# EAGLE design jlpcb-128 (EAGLE 5.11)
ABBREV: jn6; PROJECT: JeeNode v6

## Sheet 1 of 2
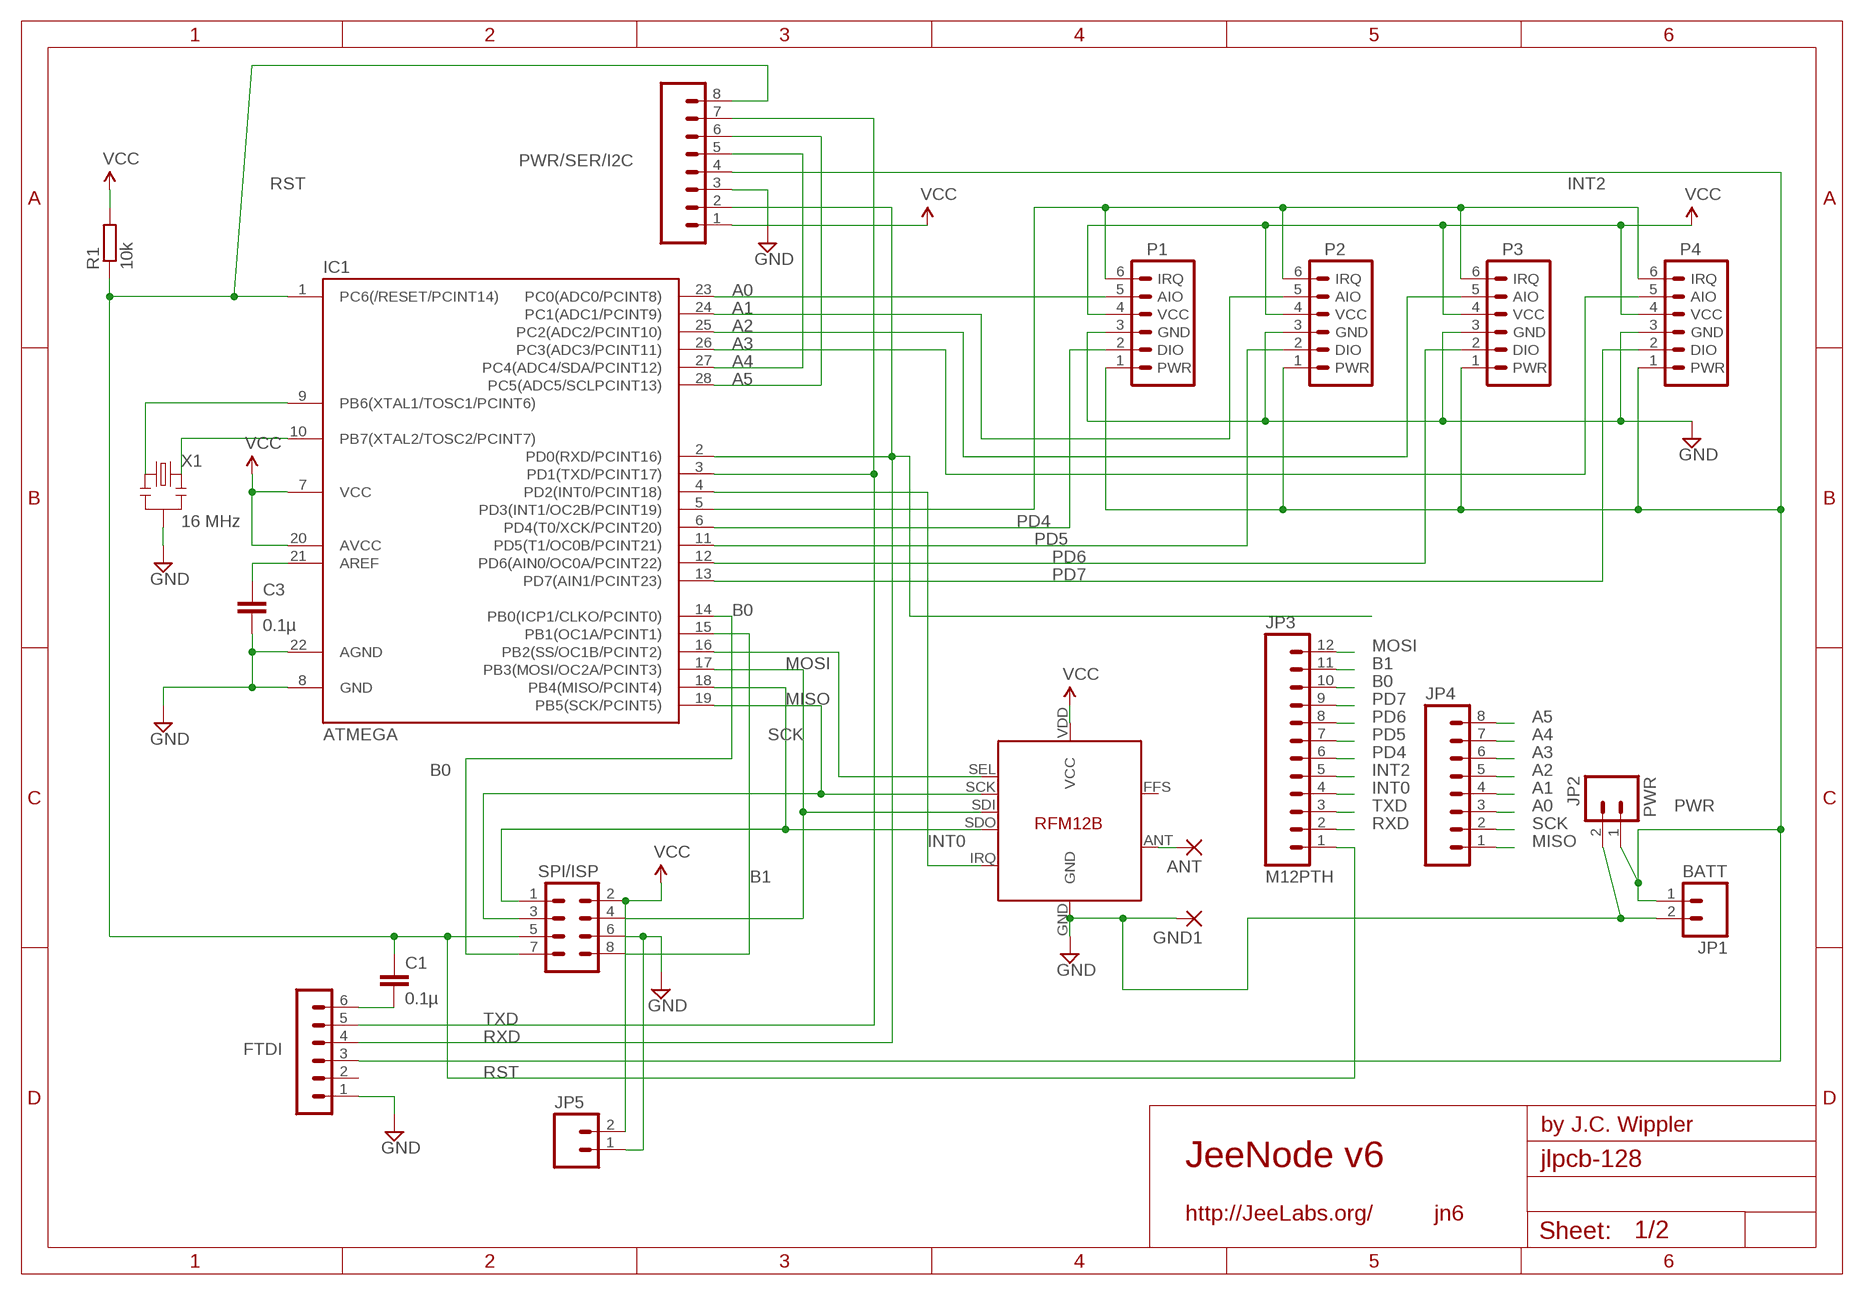
[diagram p0: schematic, sheet 1]

### Parts
ANT  1,6/0,8  [1,6/0,8]
C1  0.1µ  C-EU025-024X044  [C025-024X044]
C3  0.1µ  C-EU025-024X044  [C025-024X044]
FTDI  FTDI  MA06-1  [MA06-1]
GND1  1,6/0,8  [1,6/0,8]
IC1  ATMEGA  ATMEGA48/88/168-PU  [DIL28-3]
JP1  BATT  M02LOCK_LONGPADS  [1X02_LOCK_LONGPADS]
JP2  PWR  M02PTH  [1X02]
JP3  M12PTH  [1X12]
JP4  M081X08  [1X08]
JP5  M02PTH  [1X02]
P1  JEEPORT  JEEPORT-FEMALE  [1X06_FEMALE_LOCK.010]
P2  JEEPORT  JEEPORT-FEMALE  [1X06_FEMALE_LOCK.010]
P3  JEEPORT  JEEPORT-FEMALE  [1X06_FEMALE_LOCK.010]
P4  JEEPORT  JEEPORT-FEMALE  [1X06_FEMALE_LOCK.010]
PWR/SER/I2C  M081X08  [1X08]
R1  10k  R-EU_0204/7  [0204/7]
SV7  SPI/ISP  MA04-2  [MA04-2]
U$1  RFM12B  [RFM12B]
X1  16 MHz  RESONATORPTH  [RESONATOR-PTH]

### Nets
A0: IC1.23(PC0(ADC0/PCINT8)) JP4.3 P1.5(AIO)
A1: IC1.24(PC1(ADC1/PCINT9)) JP4.4 P2.5(AIO)
A2: IC1.25(PC2(ADC2/PCINT10)) JP4.5 P3.5(AIO)
A3: IC1.26(PC3(ADC3/PCINT11)) JP4.6 P4.5(AIO)
A4: IC1.27(PC4(ADC4/SDA/PCINT12)) JP4.7 PWR/SER/I2C.5
A5: IC1.28(PC5(ADC5/SCLPCINT13)) JP4.8 PWR/SER/I2C.6
B0: IC1.14(PB0(ICP1/CLKO/PCINT0)) JP3.10 SV7.7 ; also sheet 2
B1: IC1.15(PB1(OC1A/PCINT1)) JP3.11 SV7.8
GND [power]: C3.2 FTDI.1 GND1.1(P) IC1.8(GND) IC1.22(AGND) JP1.2 JP2.2 JP5.1 P1.3(GND) P2.3(GND) P3.3(GND) P4.3(GND) PWR/SER/I2C.3 SV7.6 U$1.GND X1.2 ; also sheet 2
INT0: IC1.4(PD2(INT0/PCINT18)) JP3.4 U$1.IRQ
INT2: IC1.5(PD3(INT1/OC2B/PCINT19)) JP3.5 P1.6(IRQ) P2.6(IRQ) P3.6(IRQ) P4.6(IRQ) ; also sheet 2
MISO: IC1.18(PB4(MISO/PCINT4)) JP4.1 SV7.1 U$1.SDO ; also sheet 2
MOSI: IC1.17(PB3(MOSI/OC2A/PCINT3)) JP3.12 SV7.4 U$1.SDI ; also sheet 2
N$1: IC1.9(PB6(XTAL1/TOSC1/PCINT6)) X1.1
N$4: IC1.16(PB2(SS/OC1B/PCINT2)) U$1.SEL
N$13: ANT.1(P) U$1.ANT
N$19: C3.1 IC1.21(AREF)
N$20: C1.2 FTDI.6
N$21: IC1.10(PB7(XTAL2/TOSC2/PCINT7)) X1.3
PD4: IC1.6(PD4(T0/XCK/PCINT20)) JP3.6 P1.2(DIO)
PD5: IC1.11(PD5(T1/OC0B/PCINT21)) JP3.7 P2.2(DIO)
PD6: IC1.12(PD6(AIN0/OC0A/PCINT22)) JP3.8 P3.2(DIO)
PD7: IC1.13(PD7(AIN1/PCINT23)) JP3.9 P4.2(DIO)
PWR [power]: FTDI.3 JP1.1 JP2.1 P1.1(PWR) P2.1(PWR) P3.1(PWR) P4.1(PWR) PWR/SER/I2C.4 ; also sheet 2
RST: C1.1 IC1.1(PC6(/RESET/PCINT14)) JP3.1 PWR/SER/I2C.8 R1.1 SV7.5 ; also sheet 2
RXD: FTDI.4 IC1.2(PD0(RXD/PCINT16)) JP3.2 PWR/SER/I2C.2
SCK: IC1.19(PB5(SCK/PCINT5)) JP4.2 SV7.3 U$1.SCK ; also sheet 2
TXD: FTDI.5 IC1.3(PD1(TXD/PCINT17)) JP3.3 PWR/SER/I2C.7
VCC [power]: IC1.7(VCC) IC1.20(AVCC) JP5.2 P1.4(VCC) P2.4(VCC) P3.4(VCC) P4.4(VCC) PWR/SER/I2C.1 R1.2 SV7.2 U$1.VDD(VCC) ; also sheet 2
Unconnected: FTDI.2 U$1.FFS

## Sheet 2 of 2
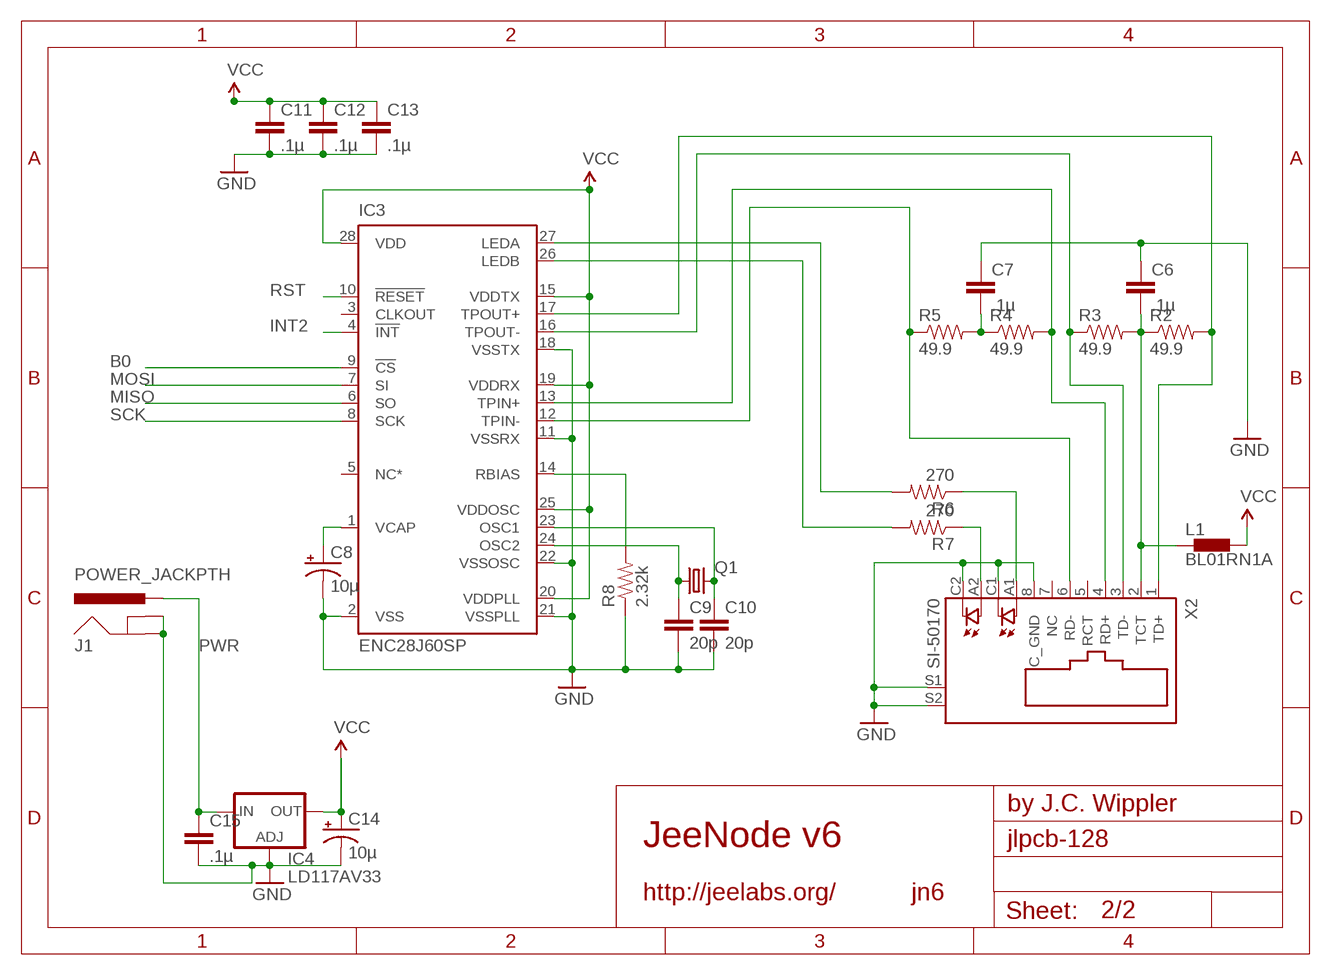
[diagram p1: schematic, sheet 2]

### Parts
C6  .1µ  CAPPTH  [CAP-PTH-SMALL]
C7  .1µ  CAPPTH  [CAP-PTH-SMALL]
C8  10µ  CAP_POLPTH2  [CPOL-RADIAL-10UF-25V]
C9  20p  CAPPTH  [CAP-PTH-SMALL]
C10  20p  CAPPTH  [CAP-PTH-SMALL]
C11  .1µ  CAPPTH  [CAP-PTH-SMALL]
C12  .1µ  CAPPTH  [CAP-PTH-SMALL]
C13  .1µ  CAPPTH  [CAP-PTH-SMALL]
C14  10µ  CAP_POLPTH2  [CPOL-RADIAL-10UF-25V]
C15  .1µ  CAPPTH  [CAP-PTH-SMALL]
IC3  ENC28J60SP  [DIL28-3]
IC4  LD117AV33  [TO220L1]
J1  POWER_JACKPTH  [POWER_JACK_PTH]
L1  BL01RN1A  [BL01RN1A]
Q1  CRYSTALHC49US  [HC49US]
R2  49.9  RESISTORPTH1  [AXIAL-0.3]
R3  49.9  RESISTORPTH1  [AXIAL-0.3]
R4  49.9  RESISTORPTH1  [AXIAL-0.3]
R5  49.9  RESISTORPTH1  [AXIAL-0.3]
R6  270  RESISTORPTH1  [AXIAL-0.3]
R7  270  RESISTORPTH1  [AXIAL-0.3]
R8  2.32k  RESISTORPTH1  [AXIAL-0.3]
X2  SI-50170  [SI-50170]

### Nets
B0: IC3.9(!CS) ; also sheet 1
GND [power]: C6.1 C7.1 C8.2(-) C9.2 C10.2 C11.2 C12.2 C13.2 C14.2(-) C15.2 IC3.2(VSS) IC3.11(VSSRX) IC3.18(VSSTX) IC3.21(VSSPLL) IC3.22(VSSOSC) IC4.1(ADJ) J1.GND J1.GNDBREAK R8.P$1 X2.8(C_GND) X2.C1(C) X2.C2(C1) X2.S1 X2.S2 ; also sheet 1
INT2: IC3.4(!INT) ; also sheet 1
MISO: IC3.6(SO) ; also sheet 1
MOSI: IC3.7(SI) ; also sheet 1
N$17 [power]: C6.2 L1.1 R2.P$1 R3.P$2 X2.2(TCT)
N$23 [power]: IC3.17(TPOUT+) R2.P$2 X2.1(TD+)
N$26 [power]: IC3.16(TPOUT-) R3.P$1 X2.3(TD-)
N$27 [power]: IC3.13(TPIN+) R4.P$2 X2.4(RD+)
N$28 [power]: IC3.12(TPIN-) R5.P$1 X2.6(RD-)
N$29: R6.P$1 X2.A1(A)
N$30: R7.P$1 X2.A2(A1)
N$31: IC3.26(LEDB) R7.P$2
N$32: IC3.27(LEDA) R6.P$2
N$33: C8.1(+) IC3.1(VCAP)
N$34: IC3.14(RBIAS) R8.P$2
N$35 [power]: C9.1 IC3.24(OSC2) Q1.1
N$36 [power]: C10.1 IC3.23(OSC1) Q1.2
N$37 [power]: C7.2 R4.P$1 R5.P$2
PWR [power]: C15.1 IC4.3(IN) J1.PWR ; also sheet 1
RST: IC3.10(!RESET) ; also sheet 1
SCK: IC3.8(SCK) ; also sheet 1
VCC [power]: C11.1 C12.1 C13.1 C14.1(+) IC3.15(VDDTX) IC3.19(VDDRX) IC3.20(VDDPLL) IC3.25(VDDOSC) IC3.28(VDD) IC4.2(OUT) L1.2 ; also sheet 1
Unconnected: IC3.3(CLKOUT) IC3.5(NC*) X2.5(RCT) X2.7(NC)

## Library data of the parts
ANT GND1 = JeeLabs:1,6/0,8: THROUGH-HOLE PAD
C1 C3 = resistor:C-EU: CAPACITOR, European symbol
C6 C7 C9-C13 C15 = SparkFun:CAP: Capacitor Standard 0603 ceramic capacitor, and 0.1" leaded capacitor.
C8 C14 = SparkFun:CAP_POL: Capacitor Polarized These are standard SMD and PTH capacitors. Normally 10uF, 47uF, and 100uF in electrolytic and tantalum varieties. Always verify the external diameter of the through hole cap, it varies with capacity, voltage, and manufacturer. The EIA devices should be standard.
FTDI = JeeLabs:MA06-1: PIN HEADER
IC1 = atmega8:ATMEGA48/88/168-PU
IC3 = microchip:ENC28J60: Stand-Alone Ethernet Controller with SPI Interface Source: http://ww1.microchip.com/downloads/en/DeviceDoc/39662c.pdf
IC4 = v-reg:LD117A?*: Low drop fixed and adjustable positive voltage regulators 1 A Source: http://www.st.com/stonline/products/literature/ds/7194/ld1117axx.pdf
J1 = SparkFun:POWER_JACK: Power Jack This is the standard 5.5mm barrel jack for power. The PTH is the most common, proven, reliable, footprint. All others are experimental. The Slot footprint only works if the mill layer is transmitted to the PCB fab house so be warned. Spark Fun Electronics SKU : PRT-00119. Mating wall wart : TOL-00298 (and others)
JP1 JP2 JP5 = SparkFun:M02: Header 2 Standard 2-pin 0.1" header. Use with straight break away headers (SKU : PRT-00116), right angle break away headers (PRT-00553), swiss pins (PRT-00743), machine pins (PRT-00117), and female headers (PRT-00115). Molex polarized connector foot print use with SKU : PRT-08233 with associated crimp pins and housings.
JP3 = SparkFun:M12: Header 12 Standard 12-pin 0.1" header. Use with straight break away headers (SKU : PRT-00116), right angle break away headers (PRT-00553), swiss pins (PRT-00743), machine pins (PRT-00117), and female headers (PRT-00115).
JP4 PWR/SER/I2C = SparkFun:M08: Header 8 Standard 8-pin 0.1" header. Use with straight break away headers (SKU : PRT-00116), right angle break away headers (PRT-00553), swiss pins (PRT-00743), machine pins (PRT-00117), and female headers (PRT-00115).
L1 = inductors:BL0: Noise Suppression Products/EMI Suppression Filters, Lead EMIFIL(R) Inductor Type Source: http://www.murata.com .. BL01RN1_DS.pdf
P1-P4 = JeeLabs:JEEPORT: PIN HEADER
Q1 = SparkFun:CRYSTAL: Crystals Various standard crystals. Proven footprints. Spark Fun Electronics SKU : COM-00534
R1 = resistor:R-EU_: RESISTOR, European symbol
R2-R8 = SparkFun:RESISTOR: Resistor Basic schematic elements and footprints for 0603, 1206, and PTH 1/10th watt (small) resistors.
SV7 = JeeLabs:MA04-2: PIN HEADER
U$1 = JeeLabs:RFM12B
X1 = SparkFun:RESONATOR: Resonator Small SMD resonator. This is the itty bitty 10/20MHz resonators with built in caps. CSTCE10M0G55 and CSTCE20M0V53. Footprint has been reviewed closely but hasn't been tested yet.
X2 = con-stewart:SI-50170: Ethernet Connector MagJack (R) Source: www.stewartconnector.com .. si-50170.pdf

## Net classes
1 power: width 0.381 mm, clearance 0.254 mm

## Board
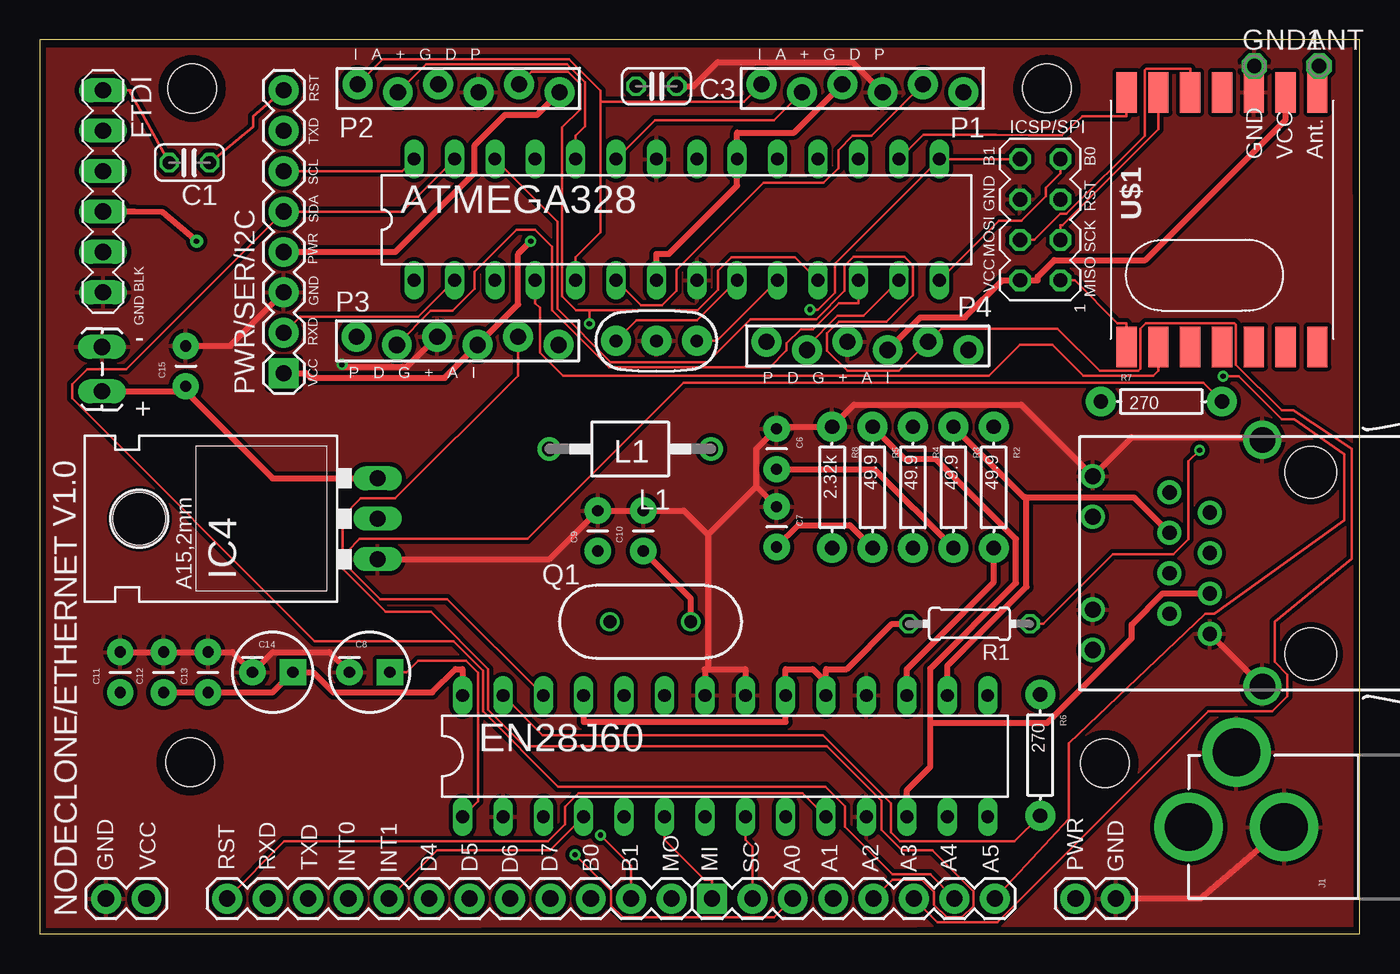
[diagram p2: board, top side]
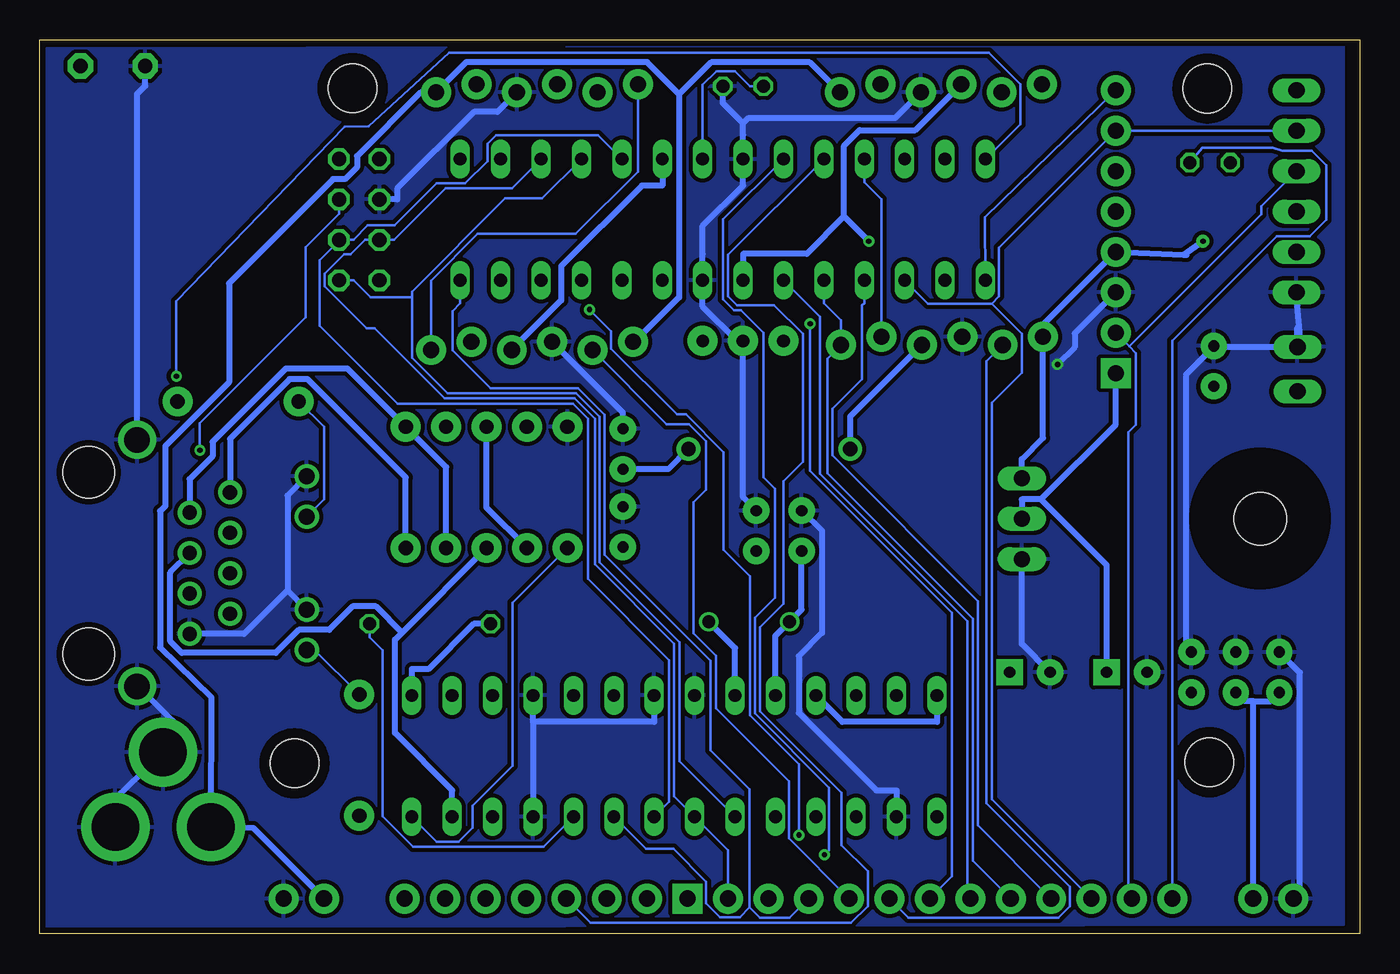
[diagram p3: board, bottom side, seen from below]

Size 82.99 x 56.2 mm. Coordinates in mm from the lower left corner, seen from the top.
Outline: 0,0 82.99,0.03 82.99,56.2 0,56.2 0,0
Copper layers (1*16): Top 0.0356mm / dielectric 1.5011mm / Bottom 0.0356mm
Design rules "LaenPCBOrder": minimum track width 6mil, minimum drill 13mil, track to track 6mil, track to pad 6mil, pad to pad 6mil, via to via 6mil, smd to smd 6mil, copper to edge 15mil, drill to drill 6mil, minimum pad ring 7mil, minimum via ring 7mil, stop-mask expansion 4mil, vias tented up to drill 0mil, thermal gap 10mil

### Footprints (pad centres in the part's own frame; a part is rotated, then mirrored left to right if it is on the bottom)
1,6/0,8 = drill 0.9 pad 1.6 octagon: 1 0,0
C025-024X044 = drill 0.813 octagon: 1 -1.27,0; 2 1.27,0
CAP-PTH-SMALL = drill 0.7 pad 1.651 round: 1 0,0; 2 2.54,0
CPOL-RADIAL-10UF-25V = drill 0.7 pad 1.651 square: 1 1.27,0 | drill 0.7 pad 1.651 round: 2 -1.27,0
MA06-1 = drill 1.016 long: 1 0,0; 2 2.54,0; 3 5.08,0; 4 7.62,0; 5 10.16,0; 6 12.7,0
DIL28-3 = drill 0.813 long: 1 -16.51,-3.81; 2 -13.97,-3.81; 3 -11.43,-3.81; 4 -8.89,-3.81; 5 -6.35,-3.81; 6 -3.81,-3.81; 7 -1.27,-3.81; 8 1.27,-3.81; 9 3.81,-3.81; 10 6.35,-3.81; 11 8.89,-3.81; 12 11.43,-3.81; 13 13.97,-3.81; 14 16.51,-3.81; 15 16.51,3.81; 16 13.97,3.81; 17 11.43,3.81; 18 8.89,3.81; 19 6.35,3.81; 20 3.81,3.81; 21 1.27,3.81; 22 -1.27,3.81; 23 -3.81,3.81; 24 -6.35,3.81; 25 -8.89,3.81; 26 -11.43,3.81; 27 -13.97,3.81; 28 -16.51,3.81
TO220L1 = drill 1.016 long: 1 -2.54,-3.81; 2 0,-3.81; 3 2.54,-3.81 | hole 3.302: 0,11.176
POWER_JACK_PTH = drill 2.997 pad 4.318 round: GND 0,7.7; GNDBREAK 4.7,10.7; PWR 0,13.7
1X02_LOCK_LONGPADS = drill 1.016 long: 1 -0.127,0; 2 2.667,0
1X02 = drill 1.016 pad 1.88 round: 1 0,0; 2 2.54,0
1X12 = drill 1.016 pad 1.88 round: 1 0,0; 2 2.54,0; 3 5.08,0; 4 7.62,0; 5 10.16,0; 6 12.7,0; 7 15.24,0; 8 17.78,0; 9 20.32,0; 10 22.86,0; 11 25.4,0; 12 27.94,0
1X08 = drill 1.016 pad 1.88 square: 1 0,0 | drill 1.016 pad 1.88 round: 2 2.54,0; 3 5.08,0; 4 7.62,0; 5 10.16,0; 6 12.7,0; 7 15.24,0; 8 17.78,0
BL01RN1A = drill 0.9 pad 1.5 round: 1 -5.08,0; 2 5.08,0
1X06_FEMALE_LOCK.010 = drill 1.016 pad 1.88 round: 1 0,0.254; 2 2.54,-0.254; 3 5.08,0.254; 4 7.62,-0.254; 5 10.16,0.254; 6 12.7,-0.254
HC49US = drill 0.813 round: 1 -2.54,0; 2 2.54,0
0204/7 = drill 0.813 octagon: 1 -3.81,0; 2 3.81,0
AXIAL-0.3 = drill 0.9 pad 1.88 round: P$1 -3.81,0; P$2 3.81,0
MA04-2 = drill 0.9 octagon: 1 -3.81,-1.27; 2 -3.81,1.27; 3 -1.27,-1.27; 4 -1.27,1.27; 5 1.27,-1.27; 6 1.27,1.27; 7 3.81,-1.27; 8 3.81,1.27
RFM12B = smd 2.54 x 1.27: ANT 8,-6; FFS -8,2; GND 8,-2; IRQ -8,4; P$8 -8,0; P$9 -8,-2; P$10 -8,-4; P$12 -8,-6; P$16 8,0; SCK 8,4; SDI 8,2; SDO -8,6; SEL 8,6; VDD 8,-4
STAND-OFF-TIGHT = hole 3.048: 0,0
RESONATOR-PTH = drill 0.8 pad 1.88 round: 1 -2.54,0; 2 0,0; 3 2.54,0
SI-50170 = drill 0.9 pad 1.5 round: 1 4.445,5.842; 2 3.175,3.302; 3 1.905,5.842; 4 0.635,3.302; 5 -0.635,5.842; 6 -1.905,3.302; 7 -3.175,5.842; 8 -4.445,3.302 | drill 1.016 pad 1.5 round: A1 -5.461,10.668; A2 2.921,10.668; C1 -2.921,10.668; C2 5.461,10.668 | drill 1.6 pad 2.2 round: S1 -7.747,0; S2 7.747,0 | hole 3.251: -5.715,-3.048; 5.715,-3.048

### Placement (x,y rotation side)
ANT  80.43,54.55 0 top
C1  9.41,48.48 180 top
C3  38.77,53.28 0 top
C6  46.33,31.75 270 top
C7  46.33,26.86 270 top
C8  20.74,16.45 0 top
C9  35.09,24.07 90 top
C10  37.95,24.07 90 top
C11  5.05,15.18 90 top
C12  7.79,15.18 90 top
C13  10.58,15.18 90 top
C14  14.64,16.45 0 top
C15  9.18,34.42 90 top
FTDI  3.98,40.32 90 top
GND1  76.37,54.55 0 top
IC1  40.04,44.89 0 top
IC3  43.09,11.18 0 top
IC4  17.44,26.1 90 top
J1  85.94,6.72 90 top
JP1  3.91,34.23 90 top
JP2  65.13,2.22 0 top
JP3  11.79,2.22 0 top
JP4  42.27,2.22 0 top
JP5  4.17,2.22 0 top
L1  37.12,30.48 180 top
P1  58.08,53.15 180 top
P2  32.68,53.15 180 top
P3  19.91,37.27 0 top
P4  45.69,36.96 0 top
PWR/SER/I2C  15.34,35.24 90 top
Q1  38.39,19.62 0 top
R1  58.46,19.49 180 top
R2  59.98,28.07 270 top
R3  57.44,28.07 270 top
R4  54.9,28.07 270 top
R5  52.36,28.07 270 top
R6  62.9,11.24 270 top
R7  70.52,33.46 0 top
R8  49.82,28.07 270 top
SV7  62.9,44.89 90 top
U$1  74.33,44.89 90 top
U$2  [STAND-OFF-TIGHT]  63.32,53.16 0 top
U$3  [STAND-OFF-TIGHT]  9.45,10.79 0 top
U$4  [STAND-OFF-TIGHT]  66.98,10.72 0 top
U$5  [STAND-OFF-TIGHT]  9.58,53.14 0 top
X1  38.77,37.27 0 top
X2  76.87,23.3 90 top

### Tracks (layer width: path | path; a pad name or v marks a point on that pad's centre or on a via)
A0  (via drill 0.33 pad 0.69)
  Top 0.152: v33.65,4.98 35.92,2.72 35.92,1.78 36.66,1.04 46.16,1.04 JP4.3 | P1.5 46.17,51.15 38.68,51.15 IC1.23
  Bottom 0.152: v33.65,4.98 33.36,5.27 33.36,9.2 38.03,13.87 38.03,19.89 36.77,21.14 36.77,27.97 37.5,28.7 37.5,37.8 38.92,39.22 39.35,39.22 40.03,39.9 40.03,44.91 IC1.23
A1
  Top 0.152: IC1.24 33.69,50.15 34.3,50.76 34.3,53.54 33.16,54.68 24.3,54.68 P2.5
  Bottom 0.152: IC1.24 39.71,42.68 39.71,40.09 39.15,39.52 36.82,39.52 35.01,37.71 35.01,29.68 36.25,28.45 36.25,20.75 37.72,19.28 37.72,13.99 32.59,8.86 32.59,5.58 30.93,3.93 30.93,1.74 31.98,0.69 48.36,0.69 JP4.4
A2
  Top 0.152: P3.5 30.07,35.1 22.34,27.37 20.18,27.37 19.04,26.23 19.04,22.96 21.75,20.26 24.59,20.26 28.2,16.65 28.2,14.08 30.48,11.79 49.51,11.79 52.92,8.38 52.92,6.55 54.21,5.26 56.13,5.26 58.69,2.69 58.69,1.75 57.98,1.04 57.04,1.04 56.24,1.84 56.24,2.65 55.48,3.4 53.61,3.4 JP4.5
  Bottom 0.152: P3.5 30.07,46.18 31.15,47.26 IC1.25
A3
  Top 0.152: IC1.26 32.55,44.77 32.55,39.3 35.9,35.95 42,35.95 44.7,38.65 48.82,38.65 50.6,40.42 50.6,42.01 51.17,42.58 54.36,42.58 54.9,42.04 54.9,40.14 53.24,38.48 50.23,38.48 49.5,37.75 49.5,36.66 50.78,35.39 54.03,35.39 P4.5 56.69,38.05 63.99,38.05 66.65,35.4 69.06,35.4 69.2,35.53 69.2,38.03 69.55,38.39 75.11,38.39 75.2,38.3 75.2,35.79 78.08,32.91 78.81,32.91 82.49,30.48 82.49,23.59 77.65,19.63 77.65,17.1 78.44,16.3 78.44,14.94 77.51,14.01 73.48,14.01 60.21,0.73 56.45,0.73 JP4.6
A4
  Top 0.152: IC1.27 22.77,45.4 PWR/SER/I2C.5 5.44,35.5 3,35.5 2.04,34.54 2.04,33.65 17.3,18.4 26.02,18.4 27.86,16.55 27.86,13.98 32.6,9.25 49.4,9.25 50.64,8.01 50.64,6.72 53.62,3.74 55.99,3.74 JP4.7
A5  (via drill 0.33 pad 0.69)
  Top 0.152: PWR/SER/I2C.6 22.77,47.94 IC1.28 | v74.4,35.05 75.38,35.05 78.09,32.33 78.89,32.35 82.03,30.15 82.03,26 73.85,20.13 73.29,20.13 64.7,11.97 64.7,7.23 JP4.8
  Bottom 0.152: IC1.28 21.35,50.89 21.35,53.4 23.32,55.37 57.26,55.39 62.31,50.77 63.83,50.75 74.4,39.77 v74.4,35.05
B0
  Top 0.152: SV7.7 64.17,47.8 63.27,46.9 63.27,46.36 61.73,44.82 60.29,44.82 IC1.14
  Bottom 0.152: 38.36,1.66 38.36,9.1 40.81,11.55 40.81,17.17 47.49,23.84 47.49,32.64 49.14,34.3 54.65,34.3 57.04,36.69 57.04,39.15 56.55,39.64 IC1.14 | 38.36,1.66 37.7,1 35.87,1 JP3.10 | 38.36,1.66 38.97,1.05 40.22,1.05 41.1,1.93 41.1,3.28 43.16,5.34 44.88,5.34 IC3.9
B1  (via drill 0.33 pad 0.69)
  Top 0.152: v48.42,39.24 48.93,39.24 49.98,40.29 49.98,42.14 IC1.15 SV7.8 | v35.25,6.21 37.19,4.28 JP3.11
  Bottom 0.152: v35.25,6.21 35.25,10.66 38.33,13.74 38.33,22.48 39.99,24.14 39.99,30.29 42.36,32.65 42.93,32.65 47.07,36.78 47.07,37.89 v48.42,39.24
GND  (via drill 0.33 pad 0.69)
  Top 0.381: v19,35.8 19.16,35.63 23.1,35.63 P3.3 | X2.S2 76.71,31.22 68.66,31.22 X2.C2 61.71,33.26 51.21,33.26 R8.P$1 46.46,31.88 C6.1 45.06,30.48 45.06,28.13 | GND1.1 76.37,53.3 76.33,53.27 U$1.GND | 42.01,25.09 42.02,25.09 45.06,28.13 | 42.01,25.09 40.5,26.61 C10.2 C9.2 32.04,23.56 IC4.1 | 42.01,25.09 42.01,16.65 | 45.06,28.13 C7.1 | 42.01,16.65 44.36,16.65 IC3.21 | 42.01,16.65 41.82,16.65 IC3.22 | C8.2 18.2,17.72 14.64,17.72 C14.2 12.1,17.72 C13.2 C12.2 C11.2 | X2.8 X2.S1 | C15.2 11.98,36.96 PWR/SER/I2C.3 | P1.3 51.09,54.8 42.62,54.8 41.1,53.28 C3.2 | JP2.2 72.98,2.22 J1.GND
  Bottom 0.381: PWR/SER/I2C.3 17.92,37.74 17.92,36.88 v19,35.8 | 67.42,21.6 X2.C1 | X2.C2 67.42,27.55 67.42,21.6 | X2.8 70.16,18.86 67.42,21.6 | C10.2 38.77,27.43 X1.2 39.17,37.27 41.31,39.42 IC1.8 41.31,42.75 41.31,44.5 38.77,47.04 IC1.22 38.77,50.21 38.77,50.95 | 51.98,13.32 IC3.11 | 51.98,13.32 44.36,13.32 IC3.21 | 51.98,13.32 IC3.18 | GND1.1 76.37,53.3 76.87,52.79 X2.S2 | 38.77,50.95 38.43,51.3 29.2,51.3 P2.3 | IC3.2 29.12,9.03 30.4,9.03 35.26,13.89 35.26,17.46 33.81,18.91 33.81,25.33 C9.2 | SV7.6 60.51,46.16 60.51,46.86 55.7,51.67 54.22,51.67 P1.3 | 9.18,36.89 10.91,35.16 10.91,18.05 C13.2 | 9.18,36.89 C15.2 | 9.18,36.89 5.88,36.89 JP1.2 3.91,38.1 3.73,37.47 3.91,39.51 3.91,40.01 FTDI.1 | IC4.1 21.25,18.22 C8.2 | J1.GND 78.22,8.57 J1.GNDBREAK 74.02,12.78 X2.S1 | P4.3 46.33,32.77 C6.1 | 38.77,50.95 40.04,52.22 C3.2 | JP5.1 3.77,2.62 3.77,16.43 C11.2
  pour Bottom (isolate 0.254): 0.99,55.83 0.99,0.58 82.55,0.43 82.55,55.68
  pour Top (isolate 0.152): 2.06,55.63 82.47,55.68 82.55,0.51 0.33,0.43 0.25,55.68
INT0
  Top 0.152: U$1.IRQ 70.33,35.4 70.02,35.08 65.62,35.08 63.68,37.02 61.62,37.02 59.68,35.08 32.9,35.08 31.45,36.54 31.45,39.34 31.15,39.64 IC1.4
  Bottom 0.152: IC1.4 31.15,39.64 31.29,39.5 31.29,34.88 33.16,33 33.16,30.07 24.01,20.92 24.01,6.83 JP3.4
INT2
  Top 0.152: JP3.5 24.99,5.26 32.1,5.26 IC3.4 | 35.27,52.3 35.27,44.11 33.69,42.53 IC1.5 | 35.27,52.3 35.27,53 33.29,54.98 21.56,54.98 P2.6 | P1.6 44.27,52.3 35.27,52.3
  Bottom 0.152: JP3.5 24.31,4.59 24.31,19.8 33.47,28.95 33.47,36.16 P3.6 32.61,38.56 33.69,39.64 IC1.5 | P1.6 45.38,47.92 49.29,44 55.46,44 58.39,41.06 P4.6
MISO
  Top 0.152: SV7.1 65.08,41.08 67.77,38.39 68.33,38.39 U$1.SDO | IC3.6 39.28,5.92 41.81,3.39 42.27,3.39 JP4.1
  Bottom 0.152: 59.58,40.01 59.58,36.23 57.34,33.99 49.27,33.99 47.79,32.51 47.79,23.36 42.76,18.33 42.76,10.85 IC3.6 | 59.58,40.01 59.58,40.37 53.72,46.23 51.41,46.23 IC1.18 | 59.58,40.01 62.2,40.01 63.27,41.08 SV7.1
MOSI
  Top 0.152: SV7.4 62.54,43.62 64.17,45.26 64.55,45.26 69.47,50.18 69.47,54.29 69.57,54.39 72.33,54.39 U$1.SDI
  Bottom 0.152: JP3.12 39.73,5.27 IC3.7 43.11,8.66 43.11,18.25 48.1,23.23 48.1,32.39 49.36,33.66 57.53,33.66 61.94,38.06 62.44,38.06 65.08,40.71 65.08,41.5 63.86,42.72 63.44,42.72 62.54,43.62 SV7.4 61.18,43.62 60.73,43.62 57.48,46.88 53.3,46.88 IC1.17
N$1
  Top 0.152: X1.1 37.52,38.56 41.33,38.56 IC1.9
N$4
  Top 0.152: U$1.SEL 68.33,51.4 65.56,51.4 64.26,50.2 62.2,50.2 60.11,50.24 55.55,50.24 IC1.16
N$13
  Top 0.152: U$1.ANT 80.33,54.39 80.43,54.49 ANT.1
N$17
  Top 0.381: R3.P$2 52.49,29.21 C6.2
  Bottom 0.381: X2.2 73.57,28.58 72.14,30.02 72.14,30.92 67.52,35.54 63.64,35.54 R2.P$1 57.44,29.34 R3.P$2 | L1.1 43.47,29.21 C6.2
N$19
  Bottom 0.152: C3.1 38.34,53.28 39.29,54.22 40.46,54.22 41.31,53.37 IC1.21
N$20
  Top 0.152: FTDI.6 5.73,53.02 5.63,53.02 C1.2
N$21
  Top 0.152: X1.3 42.58,37.27 IC1.10
N$23
  Top 0.381: IC3.17 54.52,16.65 59.98,22.11 R2.P$2
  Bottom 0.381: R2.P$2 59.98,28.69 66.16,34.87 67.29,34.87 71.03,31.12 X2.1
N$26
  Top 0.381: 62.04,27.44 61.88,27.44 R3.P$1 | X2.3 68.8,27.44 62.04,27.44 | IC3.16 57.06,16.84 62.04,21.82 62.04,27.44
N$27
  Bottom 0.381: 60.22,18.94 60.66,18.5 60.66,12.63 57.06,9.03 IC3.13 | 60.22,18.94 R4.P$2 | X2.4 74.79,22.72 74.79,18.39 74.07,17.66 68.16,17.66 66.71,19.11 64.8,19.11 63.33,20.58 61.86,20.58 60.22,18.94
N$28
  Top 0.381: 56,13.27 56,16.68 61.39,22.06 61.39,24.81 56.35,29.84 54.39,29.84 R5.P$1 | 56,13.27 56,10.51 54.52,9.03 IC3.12 | X2.6 70.61,21.4 68.65,19.45 68.65,18.57 63.35,13.27 56,13.27
N$29
  Bottom 0.152: X2.A1 65.7,17.84 R6.P$1
N$30
  Bottom 0.152: X2.A2 65.11,27.32 65.11,31.86 R7.P$1
N$31
  Top 0.152: R7.P$2 73.16,34.63 40.49,34.63 30.68,24.83 20.12,24.83 19.35,24.05 19.35,23.09 21.41,21.02 25.62,21.02 IC3.26
N$32
  Top 0.152: R6.P$2 61.28,5.81 54.09,5.81 53.51,6.39 53.51,8.22 49.24,12.49 31.61,12.49 IC3.27
N$33
  Top 0.152: C8.1 23.06,16.45 23.79,17.18 26.81,17.18 27.56,16.43 27.56,8.35 IC3.1
N$34
  Bottom 0.152: R8.P$2 53.27,20.81 53.27,10.58 55.79,8.06 55.79,6.68 56.67,5.8 58.04,5.8 IC3.14
N$35
  Bottom 0.381: C9.1 35.09,20.38 Q1.1 36.74,18.73 IC3.24
N$36
  Top 0.381: Q1.2 40.93,21.08 C10.1
  Bottom 0.381: IC3.23 39.28,17.97 Q1.2
N$37
  Top 0.381: R5.P$2 50.93,25.69 47.7,25.69 C7.2
  Bottom 0.381: R5.P$2 54.9,26.8 R4.P$1
PD4
  Top 0.152: P1.2 52.29,50.15 51.09,50.15 50.2,49.26 50.2,48.13 49.28,47.21 45.5,47.21 40.04,41.75 40.04,40.41 39.13,39.5 37.82,39.5 IC1.6
  Bottom 0.152: IC1.6 33.94,38.79 33.94,28.94 24.67,19.67 24.67,2.41 JP3.6
PD5  (via drill 0.33 pad 0.69)
  Top 0.152: 34.56,39.2 41.37,39.2 42.65,40.48 42.65,41.69 43.5,42.53 47.48,42.53 IC1.11 | P2.2 30.91,54.18 33.23,54.18 33.99,53.42 33.99,51.83 32.85,50.69 32.85,40.07 33.73,39.2 34.56,39.2 | v34.56,38.35 34.56,39.2
  Bottom 0.152: v34.56,38.35 34.56,29.12 25.63,20.2 25.63,3.62 JP3.7
PD6
  Top 0.152: IC1.12 51.47,39.64 50.24,39.64 48.6,38 47.85,38 46.96,37.12 46.96,36.69 45.91,35.63 35.79,35.63 32.23,39.19 32.23,43.18 31.14,44.26 29.99,44.26 27.34,41.61 27.34,40.54 25.96,39.16 24.59,39.16 P3.2
  Bottom 0.152: P3.2 23.48,36 23.48,8.22 18.23,2.98 18.23,1.73 18.94,1.02 28.36,1.02 JP3.8
PD7
  Top 0.152: P4.2 48.23,36.92 50.17,38.85 51.78,38.85 IC1.13
  Bottom 0.152: P4.2 43.57,32.04 42.18,32.04 41.09,30.96 41.09,27.92 41.88,27.13 41.88,18.9 40.47,17.49 40.47,14.18 35.9,9.61 35.9,6.02 JP3.9
PWR  (via drill 0.33 pad 0.81)
  Top 0.152: v9.86,43.54 9.94,43.52
  Top 0.381: PWR/SER/I2C.4 22.37,42.86 27.34,47.84 27.34,49.58 29.25,51.48 31.26,51.48 P2.1 | 9.18,34.1 C15.1 | IC4.3 14.64,28.64 9.18,34.1 | 9.18,34.1 5.88,34.1 JP1.1 | FTDI.3 5.94,45.4 7.74,45.34 9.94,43.52
  Bottom 0.381: 42.79,52.78 44.8,54.8 56.18,54.8 P1.1 59.04,52.9 63.05,48.88 63.05,48.19 63.8,47.43 64.56,47.43 71.1,40.9 71.1,34.67 75.11,30.66 75.11,26.89 75.43,26.58 75.43,18 72.22,14.86 J1.PWR 69.57,6.67 JP2.1 | P4.1 45.6,37.21 42.79,40.02 42.79,52.78 | P2.1 34.57,54.79 40.79,54.79 42.79,52.78 | 10.9,42.69 11.06,42.69 PWR/SER/I2C.4 19.91,38.29 P3.1 19.91,31.18 21.25,29.84 IC4.3
  Bottom 0.406: 11.06,42.69 v9.86,43.54
RST  (via drill 0.33 pad 0.69)
  Top 0.152: v72.93,30.4 72.23,29.7 72.23,24.82 71.28,23.87 67.48,23.87 63.11,19.49 R1.1 | IC3.10 47.97,8.84 33.87,8.84 33.04,8 33.04,6.91 31.95,5.82 15.38,5.82 JP3.1 | PWR/SER/I2C.8 13.41,51.38 13.41,50.72 C1.1
  Bottom 0.152: v72.93,30.4 72.93,32.11 66.28,38.76 66.28,43.16 64.17,45.26 SV7.5 | JP3.1 11.79,37.28 5.22,43.85 3.14,43.85 2.11,44.89 2.11,48.3 3.02,49.21 4.88,49.21 5.46,49.43 9.91,49.43 C1.1 | R1.1 62.27,18.66 61.43,17.82 61.43,7.39 59.52,5.49 51.32,5.49 IC3.10 | IC1.1 23.57,45.06 PWR/SER/I2C.8
RXD
  Top 0.152: PWR/SER/I2C.2 16.36,38.8 23.79,38.8 IC1.2
  Bottom 0.152: 14.49,36.93 PWR/SER/I2C.2 | JP3.2 14.54,2.44 14.54,31.52 14.07,31.99 14.07,36.51 14.49,36.93 | 14.49,36.93 6.18,45.24 6.18,45.74 FTDI.4
SCK
  Top 0.152: SV7.3 64.17,44.53 64.29,44.53 70.33,50.58 U$1.SCK | IC3.8 44.36,5.92 44.81,5.47 JP4.2
  Bottom 0.152: 64.12,43.62 65.39,42.36 65.39,38.22 60.49,33.33 49.47,33.33 48.53,32.39 48.53,22.32 43.42,17.21 43.42,8.31 IC3.8 | 64.12,43.62 63.27,43.62 62.37,44.53 60.68,44.53 58.03,47.18 56.24,47.18 54.85,48.57 54.85,49.66 54.31,50.2 47.89,50.2 IC1.19 | 64.12,43.62 SV7.3
TXD
  Bottom 0.152: 23.14,39.61 21.24,37.71 21.24,35.27 23.12,33.39 23.12,8.47 JP3.3 | 23.14,39.61 27.14,39.61 IC1.3 | 23.14,39.61 22.69,40.07 22.69,43.14 PWR/SER/I2C.7 FTDI.5
VCC  (via drill 0.33 pad 0.69)
  Top 0.381: v30.87,43.54 30.08,42.75 30.08,39.57 P3.4 25.46,34.95 17.02,34.95 16.73,35.24 PWR/SER/I2C.1 | IC3.25 34.2,13.32 46.9,13.32 IC3.20 46.9,16.65 48.61,16.65 49.44,15.82 | IC1.7 38.77,42.75 39.56,42.75 43.85,47.04 IC1.20 43.85,50.37 47.42,50.37 P1.4 | U$1.VDD 78.33,51.18 69.51,42.35 63.79,42.35 62.75,41.32 62.75,41.08 SV7.2 60.51,41.08 58.18,38.75 55.37,38.75 P4.4 | 49.44,15.82 49.44,16.65 50.75,16.65 53.59,19.49 R1.2 | 49.44,15.82 IC3.19 | C12.1 C13.1 14.64,15.18 C14.1 17.18,16.45 18.45,15.18 24.67,15.18 26.14,16.65 26.58,16.65 IC3.28
  Bottom 0.381: 32.42,45.09 32.42,49.54 31.45,50.51 27.95,50.51 P2.4 | v30.87,43.54 32.42,45.09 | 32.42,45.09 34.77,42.75 38.77,42.75 IC1.7 | IC3.28 26.58,13.32 32.54,13.32 IC3.25 | P4.4 50.2,39.81 50.2,41.97 45.13,47.04 43.85,47.04 IC1.20 | IC3.15 59.6,16.65 58.55,16.65 55.7,19.49 R1.2 | P3.4 32.04,32.51 L1.2 | 20.04,27.3 21.25,27.3 IC4.2 | PWR/SER/I2C.1 15.34,32 20.04,27.3 | 20.04,27.3 15.91,23.18 15.91,17.72 C14.1 | 6.71,14.64 5.59,14.64 C11.1 | C12.1 7.25,14.64 6.71,14.64 | JP5.2 6.71,14.64

### Text on the board
tNames: I A + G D P | I A + G D P | RST | ICSP/SPI | TXD | B1 | B0 | SCL | SDA | ATMEGA328 | GND | RST | MOSI | SCK | PWR | GND | VCC | MISO | 1 | GND BLK | - | RXD | P D G + A I | P D G + A I | VCC | + | V1.0 | L1 | EN28J60 | GND | VCC | RST | RXD | TXD | INT0 | INT1 | D4 | D5 | D6 | D7 | B0 | B1 | MO | MI | SC | A0 | A1 | A2 | A3 | A4 | A5 | PWR | GND | NODECLONE/ETHERNET